# Altium project Amber_Main_Board.PrjPCB
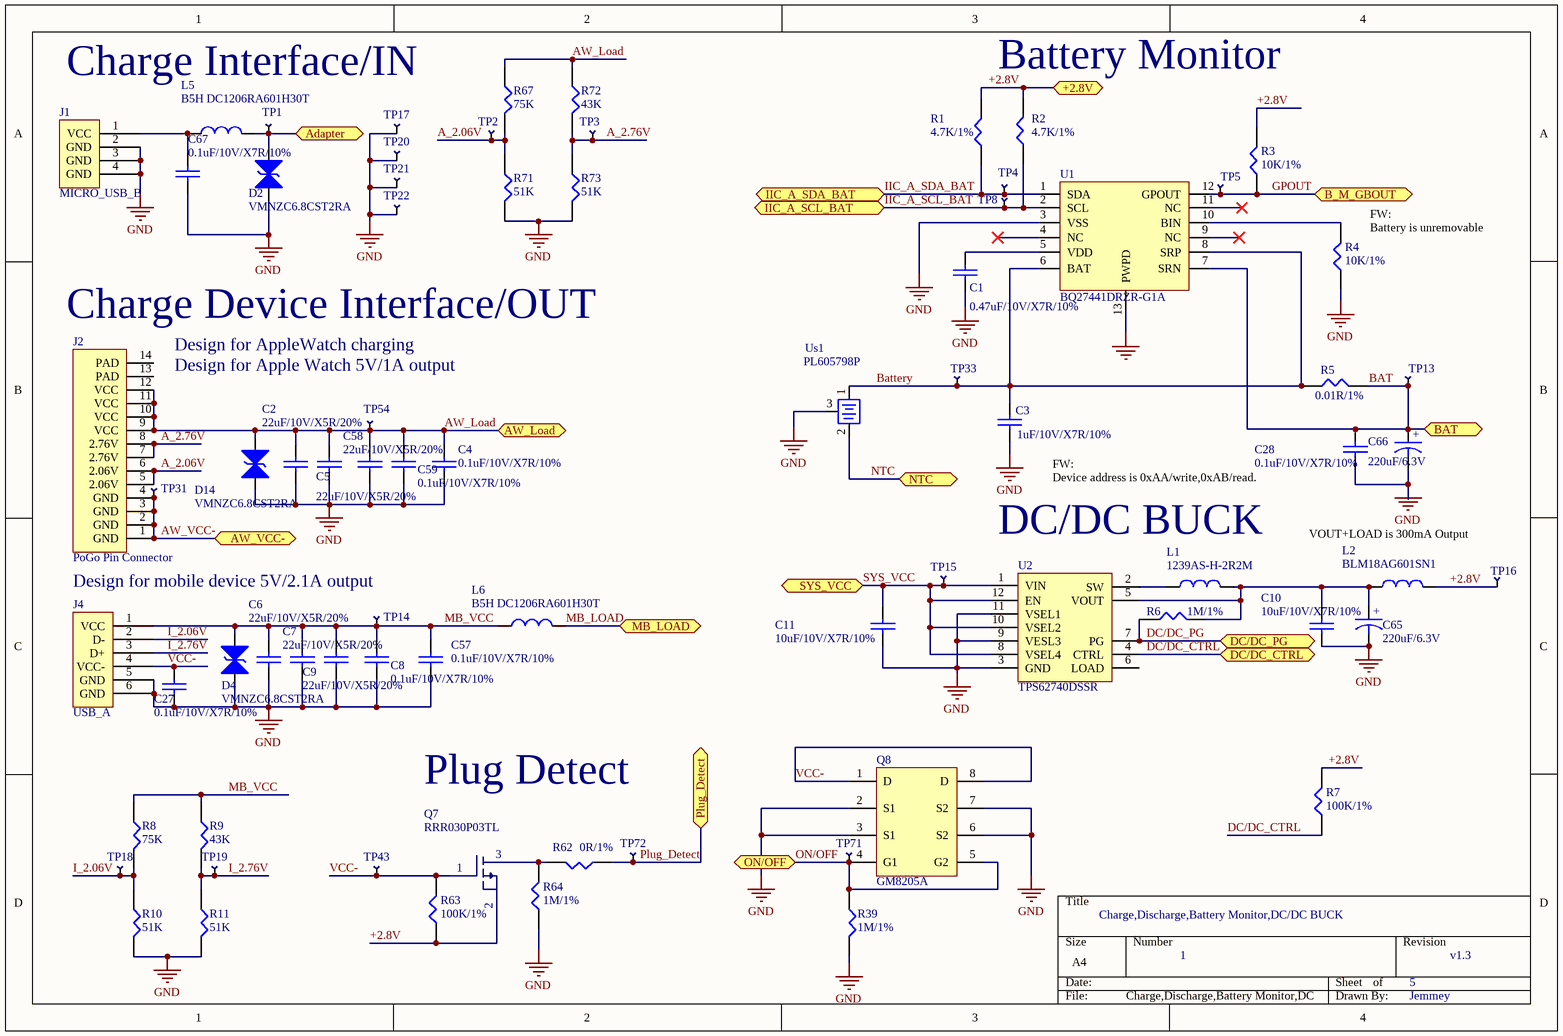
[diagram p0: Charge,Discharge,Battery Monitor,DC DC BUCK.SchDoc]
5 sheets, 237 parts. Net scope: global (net labels, ports and power ports of the same name join across sheets).
Board file: Amber_Main_Board.PcbDoc
Sheets:
  Charge,Discharge,Battery Monitor,DC DC BUCK.SchDoc
  WindCharger.SchDoc
  Management of Charging,Discharging,Tri-axis angle sensor.SchDoc
  BLE MCU,Watch Dog and Reset,EEPROM,Buzzer.SchDoc
  Breath LED,Temp,Touch key,Motor.SchDoc

## Sheet Charge,Discharge,Battery Monitor,DC DC BUCK.SchDoc
size A4

### Parts
C1  0.47uF/10V/X7R/10%  [0402C]
C2  22uF/10V/X5R/20%  [0603C]
C3  1uF/10V/X7R/10%  [0402C]
C4  0.1uF/10V/X7R/10%  [0402C]
C5  22uF/10V/X5R/20%  [0603C]
C6  22uF/10V/X5R/20%  [0603C]
C7  22uF/10V/X5R/20%  [0603C]
C8  0.1uF/10V/X7R/10%  [0402C]
C9  22uF/10V/X5R/20%  [0603C]
C10  10uF/10V/X7R/10%  [0603C]
C11  10uF/10V/X7R/10%  [0603C]
C27  0.1uF/10V/X7R/10%  [0402C]
C28  0.1uF/10V/X7R/10%  [0402C]
C57  0.1uF/10V/X7R/10%  [0402C]
C58  22uF/10V/X5R/20%  [0603C]
C59  0.1uF/10V/X7R/10%  [0402C]
C65  220uF/6.3V  [3216]
C66  220uF/6.3V  [3216]
C67  0.1uF/10V/X7R/10%  [0402C]
D2  VMNZC6.8CST2RA  [0402]
D4  VMNZC6.8CST2RA  [0402]
D14  VMNZC6.8CST2RA  [0402]
J1  MICRO_USB_B  [Micro-USB-AVX-PAD]
J2  PoGo Pin Connector  [FPC_CON12-BACK-MOLEX]
J4  USB_A  [USB-A-2]
L1  1239AS-H-2R2M  [2520-TOKO]
L2  BLM18AG601SN1  [0603R]
L5  B5H DC1206RA601H30T  [1206]
L6  B5H DC1206RA601H30T  [1206]
Q7  RRR030P03TL  [TSMT3]
Q8  GM8205A  [TSSOP-8]
R1  4.7K/1%  [0402R]
R2  4.7K/1%  [0402R]
R3  10K/1%  [0402R]
R4  10K/1%  [0402R]
R5  0.01R/1%  [0805]
R6  1M/1%  [0402R]
R7  100K/1%  [0402R]
R8  75K  [0402R]
R9  43K  [0402R]
R10  51K  [0402R]
R11  51K  [0402R]
R39  1M/1%  [0402R]
R62  0R/1%  [0402R]
R63  100K/1%  [0402R]
R64  1M/1%  [0402R]
R67  75K  [0402R]
R71  51K  [0402R]
R72  43K  [0402R]
R73  51K  [0402R]
TP1  TEST  [Test Pad]  (value not drawn)
TP2  TEST  [Test Pad]  (value not drawn)
TP3  TEST  [Test Pad]  (value not drawn)
TP4  TEST  [Test Pad]  (value not drawn)
TP5  TEST  [Test Pad]  (value not drawn)
TP8  TEST  [Test Pad]  (value not drawn)
TP13  TEST  [Test Pad]  (value not drawn)
TP14  TEST  [Test Pad]  (value not drawn)
TP15  TEST  [Test Pad]  (value not drawn)
TP16  TEST  [Test Pad]  (value not drawn)
TP17  TEST  [Test Pad]  (value not drawn)
TP18  TEST  [Test Pad]  (value not drawn)
TP19  TEST  [Test Pad]  (value not drawn)
TP20  TEST  [Test Pad]  (value not drawn)
TP21  TEST  [Test Pad]  (value not drawn)
TP22  TEST  [Test Pad]  (value not drawn)
TP31  TEST  [Test Pad]  (value not drawn)
TP33  TEST  [Test Pad]  (value not drawn)
TP43  TEST  [Test Pad]  (value not drawn)
TP54  TEST  [Test Pad]  (value not drawn)
TP71  TEST  [Test Pad]  (value not drawn)
TP72  TEST  [Test Pad]  (value not drawn)
U1  BQ27441DRZR-G1A  [DRZ]
U2  TPS62740DSSR  [DSS]
Us1  PL605798P  [Battery]

### Ports
+2.8V, Adapter (bidir), AW_Load (bidir), AW_VCC- (bidir), B_M_GBOUT, BAT, DC/DC_CTRL (bidir), DC/DC_PG (bidir), IIC_A_SCL_BAT (bidir), IIC_A_SDA_BAT (bidir), MB_LOAD (bidir), NTC, ON/OFF (bidir), Plug_Detect (bidir), SYS_VCC (bidir)

### Nets
+2.8V: L2.2 Q7.2(S) R1.2 R2.2 R3.2 R7.2 R63.1 TP16.1 ; port +2.8V
GND: C1.2 C2.2 C3.2 C4.2 C5.2 C6.2 C7.2 C8.2 C9.2 C10.2 C11.2 C27.2 C28.2 C57.2 C58.2 C59.2 C65.2 C66.2 C67.2 D2.1(Diode1) D4.1(Diode1) D14.1(Diode1) J1.2(GND) J1.3(GND) J1.4(GND) J4.5(GND) J4.6(GND) Q8.2(S1) Q8.3(S1) Q8.6(S2) Q8.7(S2) R4.1 R10.2 R11.2 R39.2 R64.1 R71.2 R73.2 TP17.1 TP20.1 TP21.1 TP22.1 U1.3(VSS) U1.13(PWPD) U2.3(GND) U2.9(VESL3) U2.11(VSEL1) Us1.3(GND)
A_2.06V: J2.5(2.06V) J2.6(2.06V) R67.2 R71.1 TP2.1
A_2.76V: J2.7(2.76V) J2.8(2.76V) R72.2 R73.1 TP3.1
Adapter: D2.2(dIode2) L5.2 TP1.1 ; port Adapter
AW_Load: C2.1 C4.1 C5.1 C58.1 C59.1 D14.2(dIode2) J2.9(VCC) J2.10(VCC) J2.11(VCC) J2.12(VCC) R67.1 R72.1 TP54.1 ; port AW_Load
AW_VCC-: J2.1(GND) J2.2(GND) J2.3(GND) J2.4(GND) TP31.1 ; port AW_VCC-
BAT: C28.1 C66.1 R5.2 TP13.1 U1.7(SRN) ; port BAT
Battery: C3.1 R5.1 TP33.1 U1.6(BAT) U1.8(SRP) Us1.1(VCC)
DC/DC_CTRL: R7.1 U2.4(CTRL) ; port DC/DC_CTRL
DC/DC_PG: R6.1 U2.7(PG) ; port DC/DC_PG
GPOUT: R3.1 TP5.1 U1.12(GPOUT) ; port B_M_GBOUT
I_2.06V: J4.2(D-) R8.2 R10.1 TP18.1
I_2.76V: J4.3(D+) R9.2 R11.1 TP19.1
IIC_A_SCL_BAT: R2.1 TP8.1 U1.2(SCL) ; port IIC_A_SCL_BAT
IIC_A_SDA_BAT: R1.1 TP4.1 U1.1(SDA) ; port IIC_A_SDA_BAT
MB_LOAD: L6.2 ; port MB_LOAD
MB_VCC: C6.1 C7.1 C8.1 C9.1 C57.1 D4.2(dIode2) J4.1(VCC) L6.1 R8.1 R9.1 TP14.1
NTC: Us1.2(NTC) ; port NTC
ON/OFF: Q8.4(G1) Q8.5(G2) R39.1 TP71.1 ; port ON/OFF
Plug_Detect: R62.1 TP72.1 ; port Plug_Detect
SYS_VCC: C11.1 TP15.1 U2.1(VIN) U2.8(VSEL4) U2.10(VSEL2) U2.12(EN) ; port SYS_VCC
VCC-: C27.1 J4.4(VCC-) Q7.1(G) Q8.1(D) Q8.8(D) R63.2 TP43.1
NetC1_1: C1.1 U1.5(VDD)
NetC10_1: C10.1 C65.1 L1.2 L2.1 R6.2 U2.5(VOUT)
NetC67_1: C67.1 J1.1(VCC) L5.1
NetL1_1: L1.1 U2.2(SW)
NetQ7_3: Q7.3(D) R62.2 R64.2
NetR4_2: R4.2 U1.10(BIN)

Not connected (* = marked no-connect by the designer): J2 13(PAD) 14(PAD); U1 4(NC)* 9(NC)* 11(NC)*; U2 6(LOAD)

### Notes on the sheet
- (near R67) Charge Interface/IN
- Battery Monitor
- (near R4) FW:
  Battery is unremovable
- (near J2) Charge Device Interface/OUT
- Design for AppleWatch charging
- Design for Apple Watch 5V/1A output
- (near C3) FW:
  Device address is 0xAA/write,0xAB/read.
- DC/DC BUCK
- VOUT+LOAD is 300mA Output
- Design for mobile device 5V/2.1A output
- Plug Detect
- Charge,Discharge,Battery Monitor,DC/DC BUCK
- 1
- 5
- v1.3
- Jemmey
- (in symbol Capacitor) +

### Library data of the parts
C1 = CAP: 厂家：Murata，型号：GRM155R71A474KE01D
C2 C5-C7 C9 C58 = CAP: 厂家：Murata，型号：GRM188R61A226ME15D
C3 = CAP: 厂家：Murata，型号：GRM155R61C105KA12D
C4 C8 C27 C28 C57 C59 C67 = CAP: 厂家：Murata，型号：GRM155R71A104KA01D
C10 C11 = CAP: 厂家：Murata，型号：GRM188R61A106KE69D
C65 C66 = Capacitor: 厂家：ROHM，型号：TAJC227K010RNJ
D2 D4 D14 = ESD_1: 厂家：ROHM，型号：VMNZC6.8CST2RA
J1 = USB_B: 厂家：AVX，型号：20-6751-005-001-007
J2 = Po: 厂家：MOLEX，型号：5034801200_sd
J4 = USB_A: 厂家：FCI，型号：87583
L1 = CHOKE: 厂家：Toko，型号1239AS-H-2R2M
L2 = CHOKE: 厂家：MURATA，型号：BLM18AG601SN1
L5 L6 = CHOKE: 厂家：宇磁，型号：B5H DC1206RA601H30T
Q7 = PMOS: 厂家：ROHM，型号：RRR030P03TL
Q8 = GM8205A: 厂家：晶群科技，型号：GM8205A
R1 R2 = RES1: 厂家：Yageo，型号：RC0402FR-074K7L
R3 R4 = RES1: 厂家：Yageo，型号：RC0402FR-0710KL
R5 = RES1: 厂家：Yageo，型号：RL0805FR-070R01L
R6 R39 = RES1: 厂家：Yageo，型号：RC0402FR-071ML
R7 = RES1: 厂家：Yageo，型号：RC0402FR-07100KL
R8 R67 = RES1: 厂家：Yageo，型号：RC0402FR-0775KL
R9 R72 = RES1: 厂家：Yageo，型号：RC0402FR-0743K9L
R10 R11 R71 R73 = RES1: 厂家：Yageo，型号：RC0402FR-0751K9L
R62 = RES1: 厂家：Yageo，型号：RC0402FR-070RL
R63 = RES: 厂家：Yageo，型号：RC0402FR-07100KL
R64 = RES: 厂家：Yageo，型号：RC0402FR-071ML
TP1-TP5 TP8 TP13-TP22 TP31 TP33 TP43 TP54 TP71 TP72 = TEST: Test Point
U1 = Bq27411: 厂家：TI，型号：BQ27441DRZR-G1A
U2 = TPS62740: 厂家：TI，型号：TPS62740DSSR
Us1 = BAT: 厂家：红亚山，型号：PL605798P

## Sheet WindCharger.SchDoc
size A4
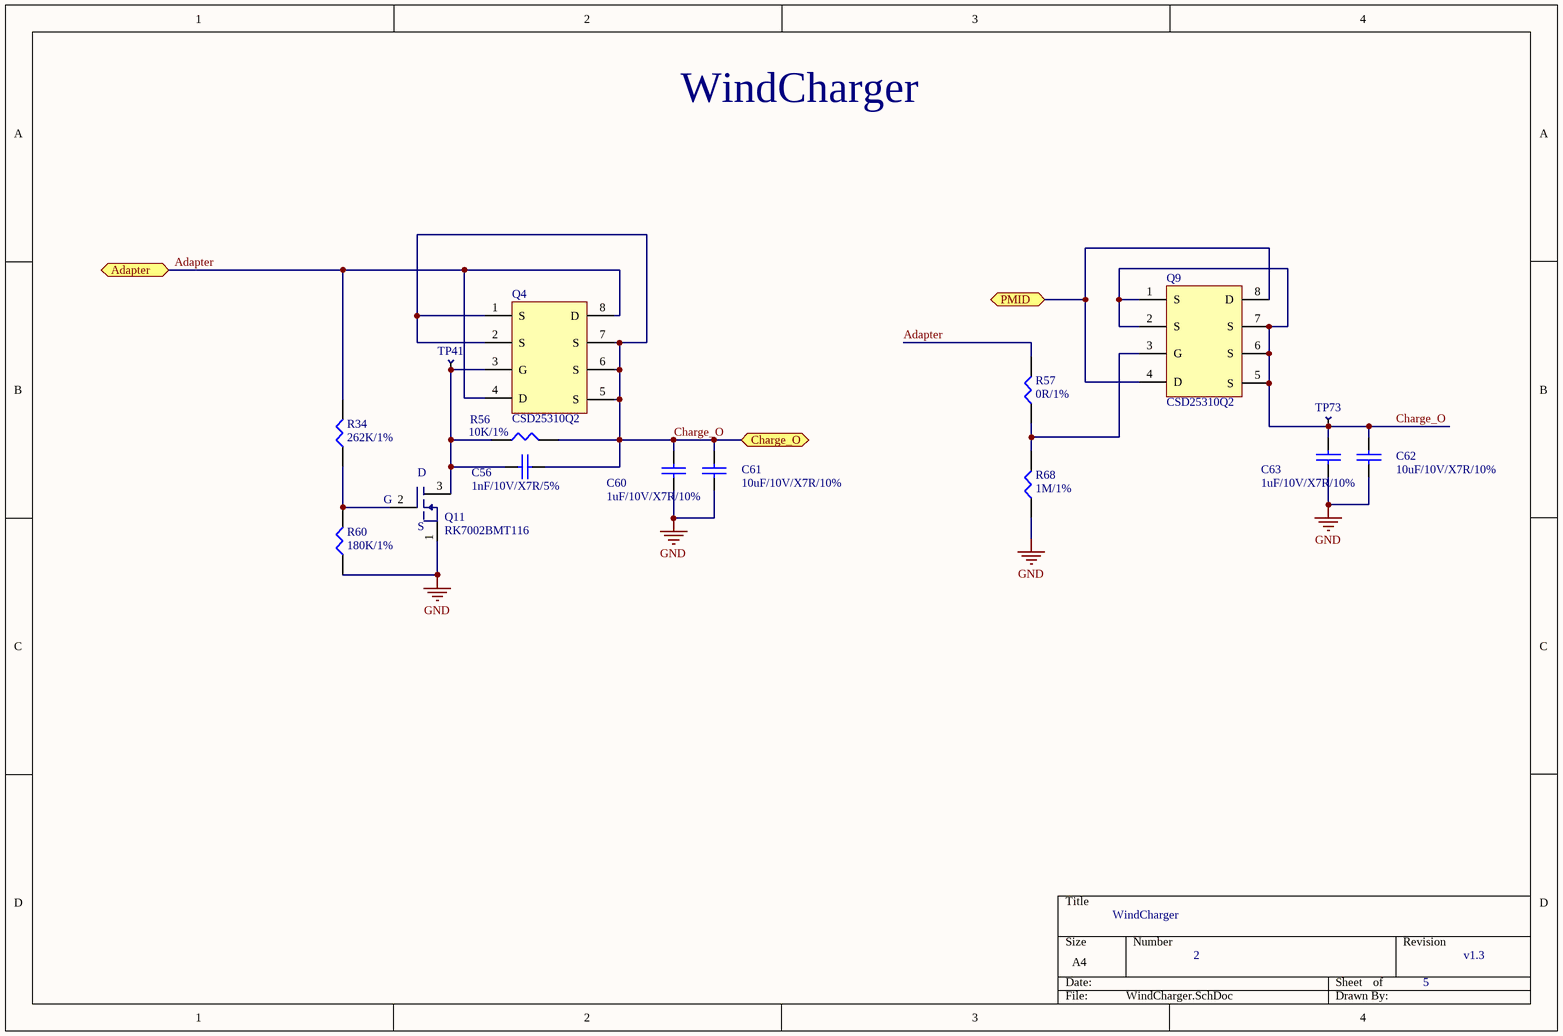
[diagram p1: WindCharger.SchDoc]

### Parts
C56  1nF/10V/X7R/5%  [0402C]
C60  1uF/10V/X7R/10%  [0402C]
C61  10uF/10V/X7R/10%  [0603C]
C62  10uF/10V/X7R/10%  [0603C]
C63  1uF/10V/X7R/10%  [0402C]
Q4  CSD25310Q2  [DQK]
Q9  CSD25310Q2  [DQK]
Q11  RK7002BMT116  [SOT23]
R34  262K/1%  [0402R]
R56  10K/1%  [0402R]
R57  0R/1%  [0402R]
R60  180K/1%  [0402R]
R68  1M/1%  [0402R]
TP41  TEST  [Test Pad]  (value not drawn)
TP73  TEST  [Test Pad]  (value not drawn)

### Ports
Adapter (bidir), Charge_O (bidir), PMID (bidir)

### Nets
GND: C60.2 C61.2 C62.2 C63.2 Q11.1(S) R60.1 R68.1
Adapter: Q4.4(D) Q4.8(D) R34.2 R57.2 ; port Adapter
Charge_O: C56.2 C60.1 C61.1 C62.1 C63.1 Q4.1(S) Q4.2(S) Q4.5(S) Q4.6(S) Q4.7(S) Q9.1(S) Q9.2(S) Q9.5(S) Q9.6(S) Q9.7(S) R56.2 TP73.1 ; port Charge_O
PMID: Q9.4(D) Q9.8(D) ; port PMID
NetC56_1: C56.1 Q4.3(G) Q11.3(D) R56.1 TP41.1
NetQ9_3: Q9.3(G) R57.1 R68.2
NetQ11_2: Q11.2(G) R34.1 R60.2

### Notes on the sheet
- WindCharger
- 2
- 5
- v1.3

### Library data of the parts
C56 = CAP: 厂家：Murata，型号：GRM1555C1H102JA01D
C60 C63 = CAP: 厂家：Murata，型号：GRM155R61C105KA12D
C61 C62 = CAP: 厂家：Murata，型号：GRM188R61A106KE69D
Q4 Q9 = CSD25310Q2: 厂家：TI，型号：   CSD25310Q2
Q11 = RK7002: 厂家：Vishay，型号：RK7002BMT116
R34 = RES1: 厂家：Yageo，型号：RC0402FR-07262KL
R56 = RES1: 厂家：Yageo，型号：RC0402FR-0710KL
R57 R68 = RES1: 厂家：Yageo，型号：RC0402FR-071ML
R60 = RES1: 厂家：Yageo，型号：RC0402FR-07180KL
TP41 TP73 = TEST: Test Point

## Sheet Management of Charging,Discharging,Tri-axis angle sensor.SchDoc
size A4
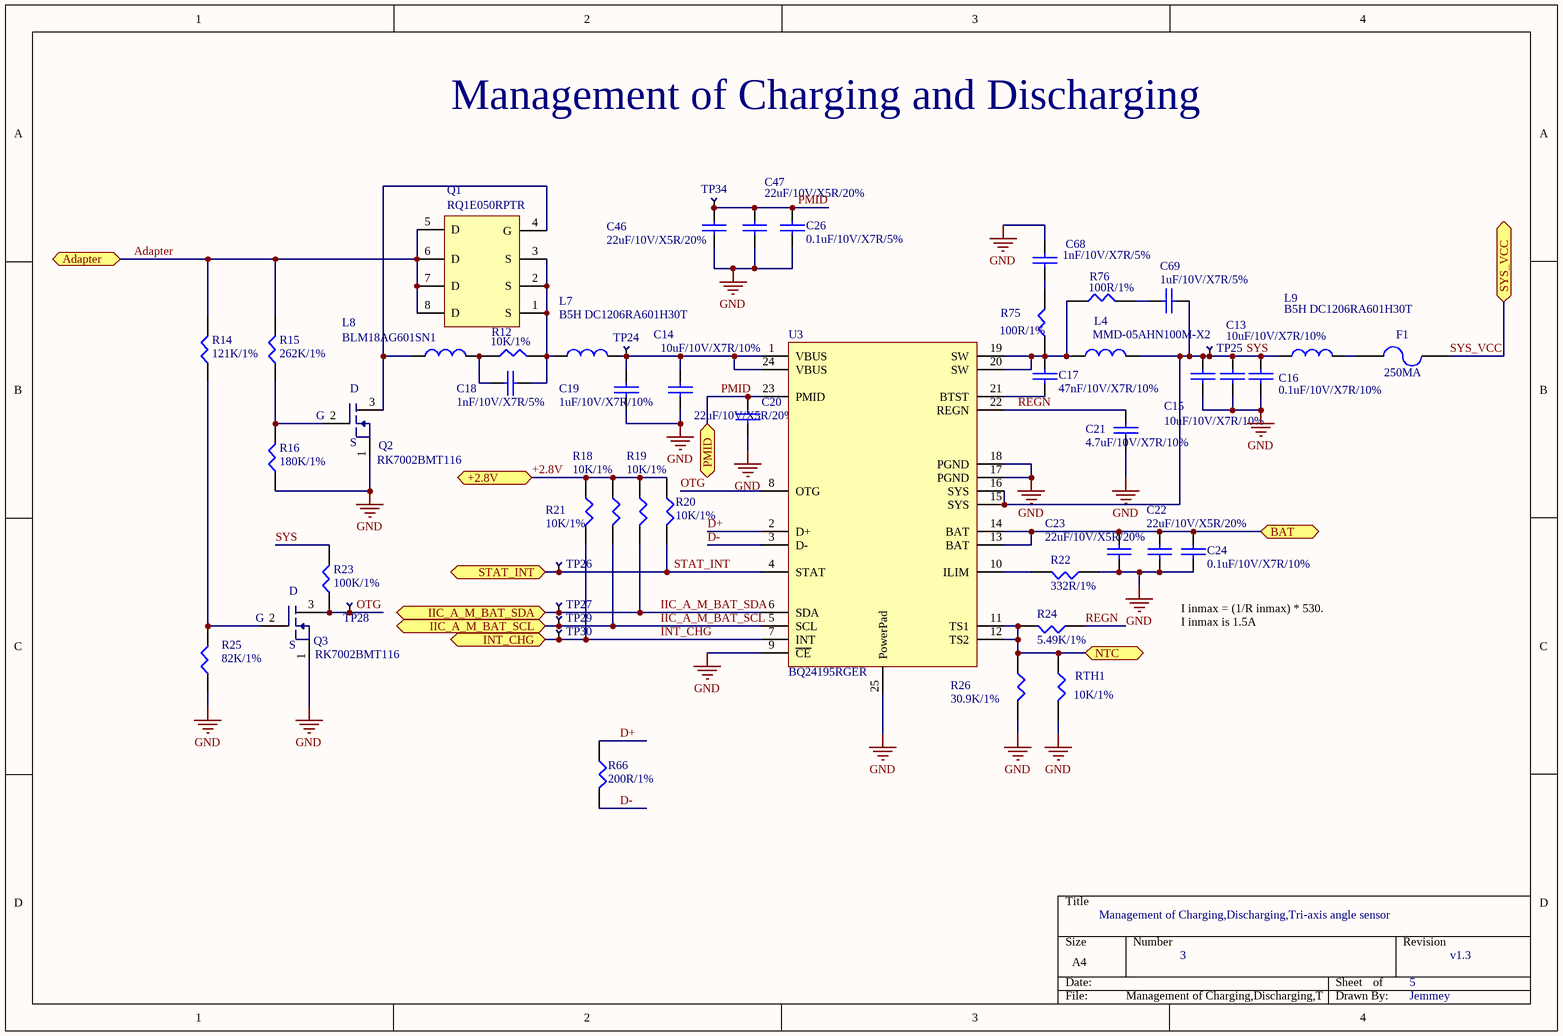
[diagram p2: Management of Charging,Discharging,Tri-axis angle sensor.SchDoc]

### Parts
C13  10uF/10V/X7R/10%  [0603C]
C14  10uF/10V/X7R/10%  [0603C]
C15  10uF/10V/X7R/10%  [0603C]
C16  0.1uF/10V/X7R/10%  [0402C]
C17  47nF/10V/X7R/10%  [0402C]
C18  1nF/10V/X7R/5%  [0402C]
C19  1uF/10V/X7R/10%  [0402C]
C20  22uF/10V/X5R/20%  [0603C]
C21  4.7uF/10V/X7R/10%  [0603C]
C22  22uF/10V/X5R/20%  [0603C]
C23  22uF/10V/X5R/20%  [0603C]
C24  0.1uF/10V/X7R/10%  [0402C]
C26  0.1uF/10V/X7R/5%  [0402C]
C46  22uF/10V/X5R/20%  [0603C]
C47  22uF/10V/X5R/20%  [0603C]
C68  1nF/10V/X7R/5%  [0603C]
C69  1uF/10V/X7R/5%  [0603C]
F1  250MA  [1206-FUSE]
L4  MMD-05AHN100M-X2  [MMD]
L7  B5H DC1206RA601H30T  [1206]
L8  BLM18AG601SN1  [0603R]
L9  B5H DC1206RA601H30T  [1206]
Q1  RQ1E050RPTR  [TSMT8]
Q2  RK7002BMT116  [SOT23]
Q3  RK7002BMT116  [SOT23]
R12  10K/1%  [0402R]
R14  121K/1%  [0402R]
R15  262K/1%  [0402R]
R16  180K/1%  [0402R]
R18  10K/1%  [0402R]
R19  10K/1%  [0402R]
R20  10K/1%  [0402R]
R21  10K/1%  [0402R]
R22  332R/1%  [0402R]
R23  100K/1%  [0402R]
R24  5.49K/1%  [0402R]
R25  82K/1%  [0402R]
R26  30.9K/1%  [0402R]
R66  200R/1%  [0402R]
R75  100R/1%  [0603R]
R76  100R/1%  [0603R]
RTH1  10K/1%  [0402R]
TP24  TEST  [Test Pad]  (value not drawn)
TP25  TEST  [Test Pad]  (value not drawn)
TP26  TEST  [Test Pad]  (value not drawn)
TP27  TEST  [Test Pad]  (value not drawn)
TP28  TEST  [Test Pad]  (value not drawn)
TP29  TEST  [Test Pad]  (value not drawn)
TP30  TEST  [Test Pad]  (value not drawn)
TP34  TEST  [Test Pad]  (value not drawn)
U3  BQ24195RGER  [RGE]

### Ports
+2.8V (bidir), Adapter (bidir), BAT, IIC_A_M_BAT_SCL, IIC_A_M_BAT_SDA, INT_CHG, NTC, PMID (bidir), STAT_INT (bidir), SYS_VCC (bidir)

### Nets
+2.8V: R18.1 R19.1 R20.1 R21.1 ; port +2.8V
GND: C13.2 C14.2 C15.2 C16.2 C19.2 C20.2 C21.2 C22.2 C23.2 C24.2 C26.1 C46.2 C47.2 C68.2 Q2.1(S) Q3.1(S) R16.1 R22.1 R25.1 R26.2 RTH1.2 U3.9(~{CE}) U3.17(PGND) U3.18(PGND) U3.25(PowerPad)
Adapter: Q1.5(D) Q1.6(D) Q1.7(D) Q1.8(D) R14.2 R15.2 ; port Adapter
BAT: C22.1 C23.1 C24.1 U3.13(BAT) U3.14(BAT) ; port BAT
D+: R66.1 U3.2(D+)
D-: R66.2 U3.3(D-)
IIC_A_M_BAT_SCL: R18.2 TP29.1 U3.5(SCL) ; port IIC_A_M_BAT_SCL
IIC_A_M_BAT_SDA: R19.2 TP27.1 U3.6(SDA) ; port IIC_A_M_BAT_SDA
INT_CHG: R21.2 TP30.1 U3.7(INT) ; port INT_CHG
NTC: R24.2 R26.1 RTH1.1 U3.11(TS1) U3.12(TS2) ; port NTC
OTG: Q3.3(D) R23.1 TP28.1 U3.8(OTG)
PMID: C20.1 C26.2 C46.1 C47.1 TP34.1 U3.23(PMID) ; port PMID
REGN: C21.1 R24.1 U3.22(REGN)
STAT_INT: R20.2 TP26.1 U3.4(STAT) ; port STAT_INT
SYS: C13.1 C15.1 C16.1 C69.1 L4.2 L9.1 R23.2 TP25.1 U3.15(SYS) U3.16(SYS)
SYS_VCC: F1.1 ; port SYS_VCC
NetC14_1: C14.1 C19.1 L7.2 TP24.1 U3.1(VBUS) U3.24(VBUS)
NetC17_1: C17.1 L4.1 R75.1 R76.1 U3.19(SW) U3.20(SW)
NetC17_2: C17.2 U3.21(BTST)
NetC18_1: C18.1 L8.2 R12.1
NetC18_2: C18.2 L7.1 Q1.1(S) Q1.2(S) Q1.3(S) R12.2
NetC68_1: C68.1 R75.2
NetC69_2: C69.2 R76.2
NetF1_2: F1.2 L9.2
NetL8_1: L8.1 Q1.4(G) Q2.3(D)
NetQ2_2: Q2.2(G) R15.1 R16.2
NetQ3_2: Q3.2(G) R14.1 R25.2
NetR22_2: R22.2 U3.10(ILIM)

### Notes on the sheet
- Management of Charging and Discharging
- I inmax = (1/R inmax) * 530.
  I inmax is 1.5A
- Management of Charging,Discharging,Tri-axis angle sensor
- 3
- 5
- v1.3
- Jemmey

### Library data of the parts
C13-C15 = CAP: 厂家：Murata，型号：GRM188R61A106KE69D
C16 C24 = CAP: 厂家：Murata，型号：GRM155R71A104KA01D
C17 = CAP: 厂家：Murata，型号：GRM155R71H473KE14D
C18 C26 C69 = CAP: 厂家：Murata，型号：GRM1555C1H102JA01D
C19 = CAP: 厂家：Murata，型号：GRM155R61C105KA12D
C20 C22 C23 C46 C47 = CAP: 厂家：Murata，型号：GRM188R61A226ME15D
C21 = CAP: 厂家：Murata，型号：GRM188R61A475KE15D
C68 = CAP: 厂家：Murata，型号：
F1 = FUSE2: 厂家：万瑞和，型号：WH1206-050
L4 = CHOKE: 厂家：Mag，型号：MMD-05AHN100M-X2
L7 L9 = CHOKE: 厂家：宇磁，型号：B5H DC1206RA601H30T
L8 = CHOKE: 厂家：MURATA，型号：BLM18AG601SN1
Q1 = RQ1: 厂家：ROHM，型号：   RQ1E050RPTR
Q2 Q3 = RK7002BMT116: 厂家：Vishay，型号：RK7002BMT116
R12 R18-R21 R75 R76 RTH1 = RES1: 厂家：Yageo，型号：RC0402FR-0710KL
R14 = RES1: 厂家：Yageo，型号：RC0402FR-07121KL
R15 = RES1: 厂家：Yageo，型号：RC0402FR-07262KL
R16 = RES1: 厂家：Yageo，型号：RC0402FR-07180KL
R22 = RES1: 厂家：Yageo，型号：RC0402FR-07332RL
R23 = RES1: 厂家：Yageo，型号：RC0402FR-07100KL
R24 = RES1: 厂家：Yageo，型号：RC0402FR-075K49L
R25 = RES1: 厂家：Yageo，型号：RC0402FR-0782KL
R26 = RES1: 厂家：Yageo，型号：RC0402FR-0730K9L
R66 = RES1: 厂家：Yageo，型号：RC0402FR-07200RL
TP24-TP30 TP34 = TEST: Test Point
U3 = BQ: 厂家：TI，型号：BQ24195RGER

## Sheet BLE MCU,Watch Dog and Reset,EEPROM,Buzzer.SchDoc
size A4
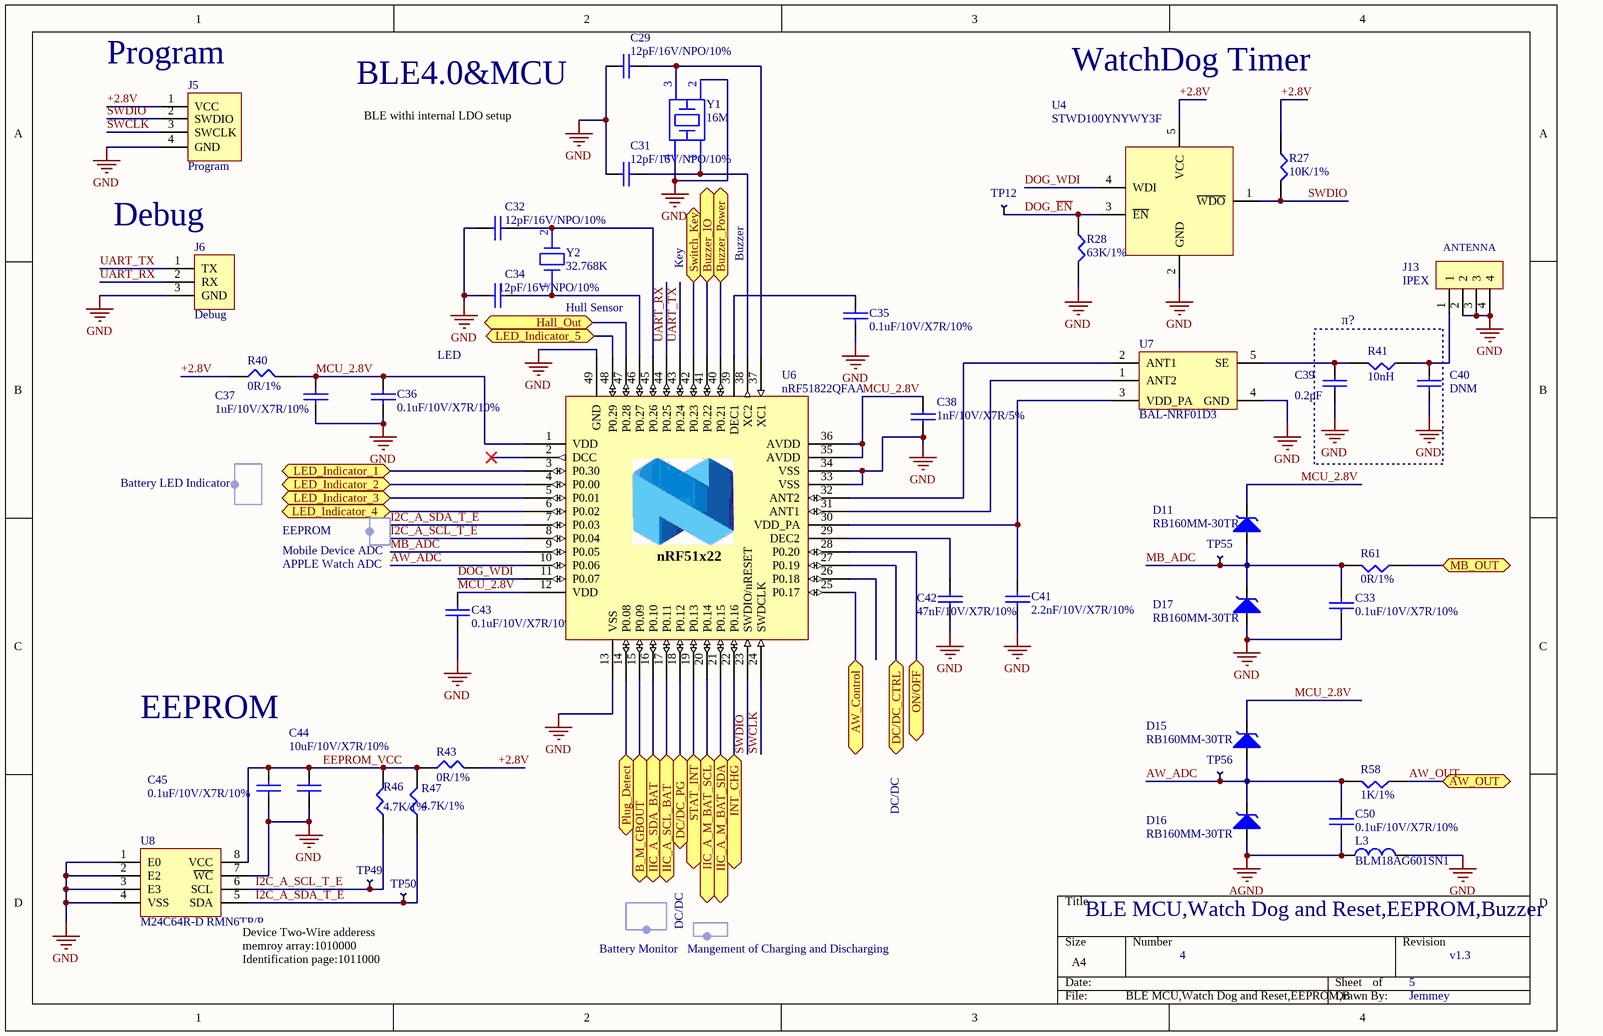
[diagram p3: BLE MCU,Watch Dog and Reset,EEPROM,Buzzer.SchDoc]

### Parts
C29  12pF/16V/NPO/10%  [0402C]
C31  12pF/16V/NPO/10%  [0402C]
C32  12pF/16V/NPO/10%  [0402C]
C33  0.1uF/10V/X7R/10%  [0402C]
C34  12pF/16V/NPO/10%  [0402C]
C35  0.1uF/10V/X7R/10%  [0402C]
C36  0.1uF/10V/X7R/10%  [0402C]
C37  1uF/10V/X7R/10%  [0402C]
C38  1nF/10V/X7R/5%  [0402C]
C39  0.2pF  [0402C]
C40  DNM  [0402C]
C41  2.2nF/10V/X7R/10%  [0402C]
C42  47nF/10V/X7R/10%  [0402C]
C43  0.1uF/10V/X7R/10%  [0402C]
C44  10uF/10V/X7R/10%  [0603C]
C45  0.1uF/10V/X7R/10%  [0402C]
C50  0.1uF/10V/X7R/10%  [0402C]
D11  RB160MM-30TR  [DO-214AC]
D15  RB160MM-30TR  [DO-214AC]
D16  RB160MM-30TR  [DO-214AC]
D17  RB160MM-30TR  [DO-214AC]
J5  Program  [PROGRAM - 1.27]
J6  Debug  [Debug- 1.27]
J13  IPEX  [IPEX]
L3  BLM18AG601SN1  [0603R]
R27  10K/1%  [0402R]
R28  63K/1%  [0402R]
R40  0R/1%  [0603R]
R41  10nH  [0402R]
R43  0R/1%  [0603R]
R46  4.7K/1%  [0402R]
R47  4.7K/1%  [0402R]
R58  1K/1%  [0402R]
R61  0R/1%  [0402R]
TP12  TEST  [Test Pad]  (value not drawn)
TP49  TEST  [Test Pad]  (value not drawn)
TP50  TEST  [Test Pad]  (value not drawn)
TP55  TEST  [Test Pad]  (value not drawn)
TP56  TEST  [Test Pad]  (value not drawn)
U4  STWD100YNYWY3F  [SOT23-5]
U6  nRF51822QFAA  [QFN48]
U7  BAL-NRF01D3  [ECOPACK]
U8  M24C64R-D RMN6TP/P  [SO8N]
Y1  16M  [XTALSMD2-2520]
Y2  32.768K  [XTALSMD2-3215]

### Blocks framed on the sheet
π?: C39 C40 R41

### Ports
AW_Control, AW_OUT (bidir), B_M_GBOUT, Buzzer_IO, Buzzer_Power, DC/DC_CTRL (bidir), DC/DC_PG (bidir), Hall_Out (bidir), IIC_A_M_BAT_SCL (bidir), IIC_A_M_BAT_SDA (bidir), IIC_A_SCL_BAT (bidir), IIC_A_SDA_BAT (bidir), INT_CHG, LED_Indicator_1 (bidir), LED_Indicator_2 (bidir), LED_Indicator_3 (bidir), LED_Indicator_4, LED_Indicator_5, MB_OUT (bidir), ON/OFF (bidir), Plug_Detect (bidir), STAT_INT, Switch_Key

### Harnesses
Battery Monitor: 
EEPROM: 
Mangement of Charging and Discharging: 
Battery LED Indicator: 

### Nets
+2.8V: J5.1(VCC) R27.1 R40.1 R43.2 U4.5(VCC)
AGND: C50.2 D16.2(A) L3.1
GND: C29.1 C31.1 C32.1 C33.2 C34.1 C35.1 C36.1 C37.1 C38.1 C39.2 C40.2 C41.1 C42.1 C43.1 C44.2 C45.2 D17.2(A) J5.4(GND) J6.3(GND) J13.2 J13.3 J13.4 L3.2 R28.2 U4.2(GND) U6.13(VSS) U6.33(VSS) U6.34(VSS) U6.49(GND) U7.4(GND) U8.1(E0) U8.2(E2) U8.3(E3) U8.4(VSS) U8.7(~{WC}) Y1.2 Y1.4
AW_ADC: C50.1 D15.2(A) D16.1(K) R58.2 TP56.1 U6.10(P0.06)
AW_OUT: R58.1 ; port AW_OUT
Buzzer_IO: U6.41(P0.22) ; port Buzzer_IO
Buzzer_Power: U6.40(P0.21) ; port Buzzer_Power
DC/DC_CTRL: U6.27(P0.19) ; port DC/DC_CTRL
DC/DC_PG: U6.18(P0.12) ; port DC/DC_PG
DOG_~{EN}: R28.1 TP12.1 U4.3(~{EN})
DOG_WDI: U4.4(WDI) U6.11(P0.07)
EEPROM_VCC: C44.1 C45.1 R43.1 R46.2 R47.2 U8.8(VCC)
GPOUT: U6.15(P0.09) ; port B_M_GBOUT
Hall_OUT: U6.47(P0.28) ; port Hall_Out
I2C_A_SCL_T_E: R46.1 TP49.1 U6.8(P0.04) U8.6(SCL)
I2C_A_SDA_T_E: R47.1 TP50.1 U6.7(P0.03) U8.5(SDA)
IIC_A_M_BAT_SCL: U6.20(P0.14) ; port IIC_A_M_BAT_SCL
IIC_A_M_BAT_SDA: U6.21(P0.15) ; port IIC_A_M_BAT_SDA
IIC_A_SCL_BAT: U6.17(P0.11) ; port IIC_A_SCL_BAT
IIC_A_SDA_BAT: U6.16(P0.10) ; port IIC_A_SDA_BAT
INT_CHG: U6.22(P0.16) ; port INT_CHG
MB_ADC: C33.1 D11.2(A) D17.1(K) R61.2 TP55.1 U6.9(P0.05)
MCU_2.8V: C36.2 C37.2 C38.2 C43.2 D11.1(K) D15.1(K) R40.2 U6.1(VDD) U6.12(VDD) U6.35(AVDD) U6.36(AVDD)
ON/OFF: U6.28(P0.20) ; port ON/OFF
Plug_Detect: U6.14(P0.08) ; port Plug_Detect
STAT_INT: U6.19(P0.13) ; port STAT_INT
SWCLK: J5.3(SWCLK) U6.24(SWDCLK)
SWDIO: J5.2(SWDIO) R27.2 U4.1(~{WDO}) U6.23(SWDIO/nRESET)
Switch_Key: U6.42(P0.23) ; port Switch_Key
UART_RX: J6.2(RX) U6.44(P0.25)
UART_TX: J6.1(TX) U6.43(P0.24)
NetC29_2: C29.2 U6.37(XC1) Y1.3
NetC31_2: C31.2 U6.38(XC2) Y1.1
NetC32_2: C32.2 U6.45(P0.26) Y2.2
NetC34_2: C34.2 U6.46(P0.27) Y2.1
NetC35_2: C35.2 U6.39(DEC1)
NetC39_1: C39.1 R41.2 U7.5(SE)
NetC40_1: C40.1 J13.1 R41.1
NetC41_2: C41.2 U6.30(VDD_PA) U7.3(VDD_PA)
NetC42_2: C42.2 U6.29(DEC2)
NetJ7_4: U6.3(P0.30) ; port LED_Indicator_1
NetJ7_5: U6.4(P0.00) ; port LED_Indicator_2
NetJ7_6: U6.5(P0.01) ; port LED_Indicator_3
NetJ7_7: U6.6(P0.02) ; port LED_Indicator_4
NetJ7_8: U6.48(P0.29) ; port LED_Indicator_5
NetQ10_2: U6.25(P0.17) ; port AW_Control
NetR61_1: R61.1 ; port MB_OUT
NetU6_31: U6.31(ANT1) U7.1(ANT2)
NetU6_32: U6.32(ANT2) U7.2(ANT1)

Not connected (* = marked no-connect by the designer): U6 2(DCC)* 26(P0.18)

### Notes on the sheet
- (near J5) Program
- BLE4.0&MCU
- WatchDog Timer
- BLE withi internal LDO setup
- Debug
- (near J13) ANTENNA
- (near Y2) Hull Sensor
- Key
- Buzzer
- LED
- APPLE Watch ADC
- Mobile Device ADC
- EEPROM
- DC/DC
- (near L3) BLE MCU,Watch Dog and Reset,EEPROM,Buzzer
- Device Two-Wire adderess
  memroy array:1010000
  Identification page:1011000
- 4
- 5
- v1.3
- Jemmey
- (in symbol nR) nRF51x22

### Library data of the parts
C29 C31 C32 C34 = CAP: 厂家：Murata，型号：GRM1555C1H120JA01D
C33 C35 C36 C43 C45 C50 = CAP: 厂家：Murata，型号：GRM155R71A104KA01D
C37 = CAP: 厂家：Murata，型号：GRM155R61C105KA12D
C38 = CAP: 厂家：Murata，型号：GRM1555C1H102JA01D
C39 = CAP: 厂家：Murata，型号：GRM1555C1H1R0BA01D
C40 = CAP: None
C41 = CAP: 厂家：Murata，型号：GRM155R71H222KA01D
C42 = CAP: 厂家：Murata，型号：GRM155R71H473KE14D
C44 = CAP: 厂家：Murata，型号：GRM188R61A106KE69D
D11 D15-D17 = Schottky barrier rec: 厂家：ROHM，型号：RB160MM-30TR
J5 = Program: 厂家：暂定，型号：暂定
J6 = Debug_1: 厂家：暂定，型号：暂定
J13 = ANTA: 厂家：Molex，型号：73420110_sd
L3 = CHOKE: 厂家：MURATA，型号：BLM18AG601SN1
R27 = RES1: 厂家：Yageo，型号：RC0402FR-0710KL
R28 = RES1: 厂家：Yageo，型号：RC0402FR-0763KL
R40 R41 R43 R58 R61 = RES1: 厂家：Yageo，型号：RC0402FR-070RL
R46 R47 = RES1: 厂家：Yageo，型号：RC0402FR-074K7L
TP12 TP49 TP50 TP55 TP56 = TEST: Test Point
U4 = S: 厂家：ST，型号：STWD100YNYWY3F
U6 = nR: 厂家：Nordic，型号：Nrf51822QFAA
U7 = BAL-NRF01D3: 厂家：ST，型号：BAL-NRF01D3
U8 = M24C64-R: 厂家：ST，型号：M24C64R-D RMN6TP/P
Y1 = CRYSTAL2: 厂家：EPSON，型号：Q24FA20H0004400
Y2 = CR: 厂家：EPSON，型号：Q13FC1350000400

## Sheet Breath LED,Temp,Touch key,Motor.SchDoc
size A4
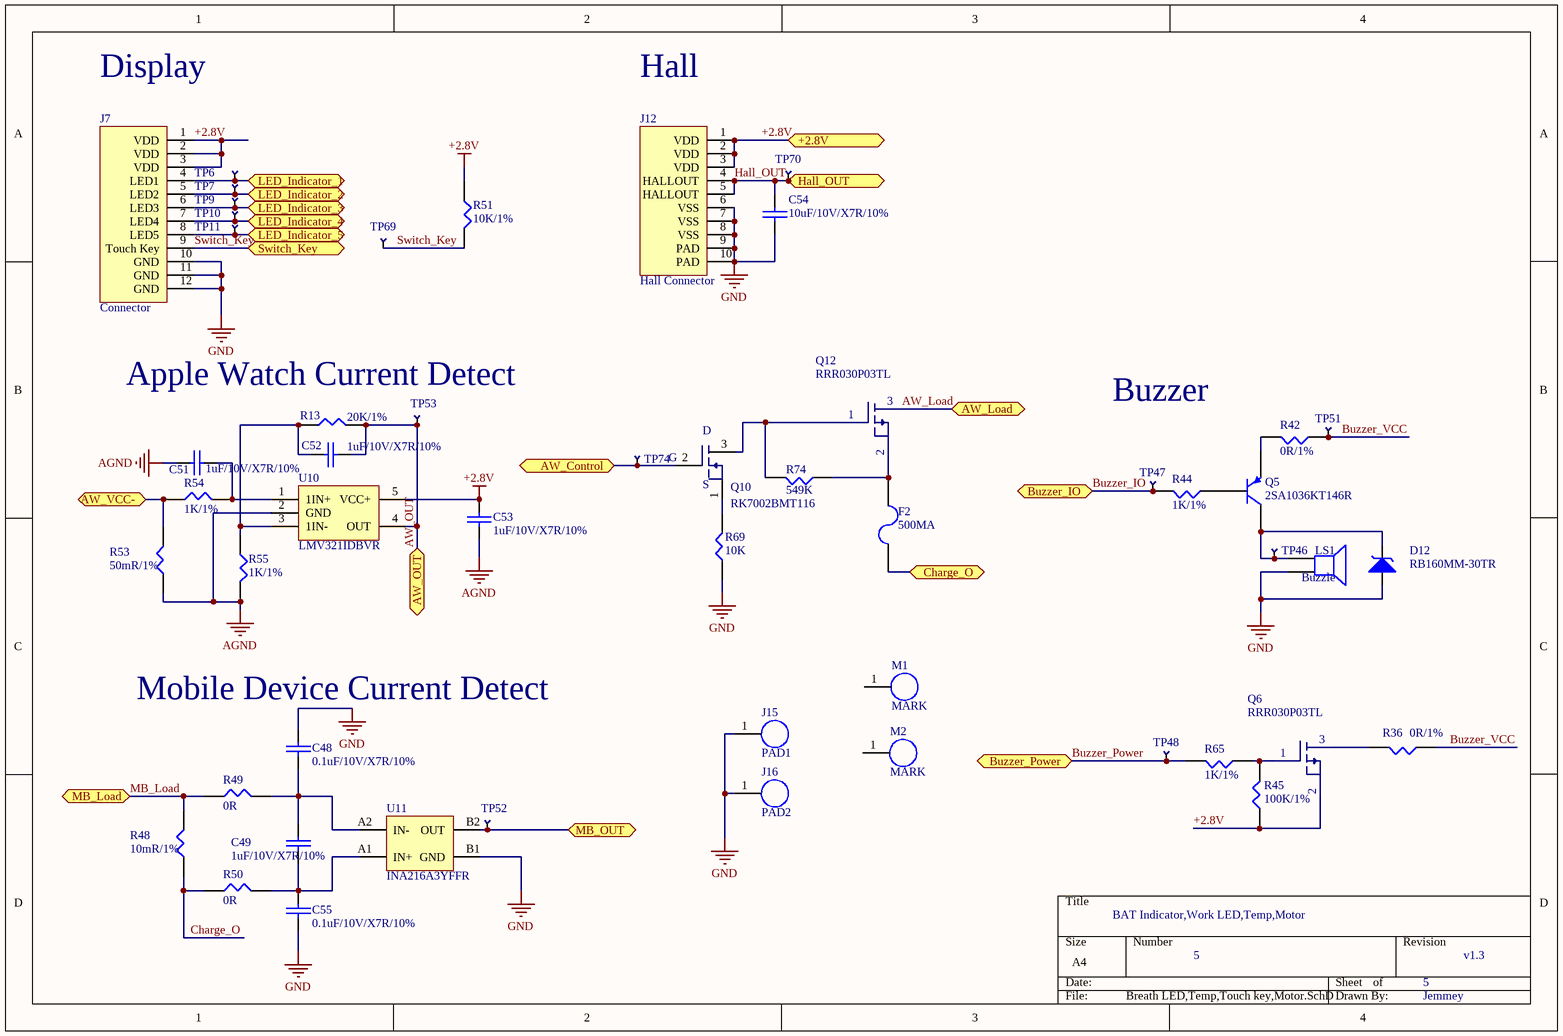
[diagram p4: Breath LED,Temp,Touch key,Motor.SchDoc]

### Parts
C48  0.1uF/10V/X7R/10%  [0402C]
C49  1uF/10V/X7R/10%  [0402C]
C51  1uF/10V/X7R/10%  [0402C]
C52  1uF/10V/X7R/10%  [0402C]
C53  1uF/10V/X7R/10%  [0402C]
C54  10uF/10V/X7R/10%  [0603C]
C55  0.1uF/10V/X7R/10%  [0402C]
D12  RB160MM-30TR  [DO-214AC]
F2  500MA  [1206-FUSE]
J7  Connector  [FPC_CON12-BACK-MOLEX]
J12  Hall Connector  [FPC_CON8-KYOCERA]
J15  PAD1  [PAD1]
J16  PAD2  [PAD2]
LS1  Buzzle  [Buzzer 7525]
M1  MARK  [Mark Point]
M2  MARK  [Mark Point]
Q5  2SA1036KT146R  [SMT3]
Q6  RRR030P03TL  [TSMT3]
Q10  RK7002BMT116  [SOT23]
Q12  RRR030P03TL  [TSMT3]
R13  20K/1%  [0402R]
R36  0R/1%  [0603R]
R42  0R/1%  [0402R]
R44  1K/1%  [0402R]
R45  100K/1%  [0402R]
R48  10mR/1%  [0805]
R49  0R  [0603R]
R50  0R  [0603R]
R51  10K/1%  [0402R]
R53  50mR/1%  [0805]
R54  1K/1%  [0402R]
R55  1K/1%  [0402R]
R65  1K/1%  [0402R]
R69  10K  [0402R]
R74  549K  [0402R]
TP6  TEST  [Test Pad]  (value not drawn)
TP7  TEST  [Test Pad]  (value not drawn)
TP9  TEST  [Test Pad]  (value not drawn)
TP10  TEST  [Test Pad]  (value not drawn)
TP11  TEST  [Test Pad]  (value not drawn)
TP46  TEST  [Test Pad]  (value not drawn)
TP47  TEST  [Test Pad]  (value not drawn)
TP48  TEST  [Test Pad]  (value not drawn)
TP51  TEST  [Test Pad]  (value not drawn)
TP52  TEST  [Test Pad]  (value not drawn)
TP53  TEST  [Test Pad]  (value not drawn)
TP69  TEST  [Test Pad]  (value not drawn)
TP70  TEST  [Test Pad]  (value not drawn)
TP74  TEST  [Test Pad]  (value not drawn)
U10  LMV321IDBVR  [SOT23-5]
U11  INA216A3YFFR  [YFF]

### Ports
+2.8V, AW_Control, AW_Load, AW_OUT (bidir), AW_VCC- (bidir), Buzzer_IO, Buzzer_Power, Charge_O, Hall_OUT, LED_Indicator_1, LED_Indicator_2, LED_Indicator_3, LED_Indicator_4, LED_Indicator_5, MB_Load (bidir), MB_OUT (bidir), Switch_Key

### Nets
+2.8V: C53.2 J7.1(VDD) J7.2(VDD) J7.3(VDD) J12.1(VDD) J12.2(VDD) J12.3(VDD) Q6.2(S) R45.1 R51.1 U10.5(VCC+) ; port +2.8V
AGND: C51.1 C53.1 R53.1 R55.2 U10.2(GND)
GND: C48.1 C54.2 C55.2 D12.2(A) J7.10(GND) J7.11(GND) J7.12(GND) J12.6(VSS) J12.7(VSS) J12.8(VSS) J12.9(PAD) J12.10(PAD) J15.1 J16.1 LS1.2 R69.1 U11.B1(GND)
AW_Load: Q12.3(D) ; port AW_Load
AW_OUT: C52.2 R13.2 TP53.1 U10.4(OUT) ; port AW_OUT
AW_VCC-: R53.2 R54.1 ; port AW_VCC-
Buzzer_IO: R44.2 TP47.1 ; port Buzzer_IO
Buzzer_Power: R65.2 TP48.1 ; port Buzzer_Power
Buzzer_VCC: R36.1 R42.1 TP51.1
Charge_O: F2.2 R48.1 R50.1 ; port Charge_O
Hall_OUT: C54.1 J12.4(HALLOUT) J12.5(HALLOUT) TP70.1 ; port Hall_OUT
MB_LOAD: R48.2 R49.1 ; port MB_Load
Switch_Key: J7.9(Touch_Key) R51.2 TP69.1 ; port Switch_Key
NetC48_2: C48.2 C49.1 R49.2 U11.A2(IN-)
NetC49_2: C49.2 C55.1 R50.2 U11.A1(IN+)
NetC51_2: C51.2 R54.2 U10.1(1IN+)
NetC52_1: C52.1 R13.1 R55.1 U10.3(1IN-)
NetD12_1: D12.1(K) LS1.1 Q5.1(E) TP46.1
NetF2_1: F2.1 Q12.2(S) R74.1
NetJ7_4: J7.4(LED1) TP6.1 ; port LED_Indicator_1
NetJ7_5: J7.5(LED2) TP7.1 ; port LED_Indicator_2
NetJ7_6: J7.6(LED3) TP9.1 ; port LED_Indicator_3
NetJ7_7: J7.7(LED4) TP10.1 ; port LED_Indicator_4
NetJ7_8: J7.8(LED5) TP11.1 ; port LED_Indicator_5
NetQ5_2: Q5.2(B) R44.1
NetQ5_3: Q5.3(C) R42.2
NetQ6_1: Q6.1(G) R45.2 R65.1
NetQ6_3: Q6.3(D) R36.2
NetQ10_1: Q10.1(S) R69.2
NetQ10_2: Q10.2(G) TP74.1 ; port AW_Control
NetQ10_3: Q10.3(D) Q12.1(G) R74.2
NetR61_1: TP52.1 U11.B2(OUT) ; port MB_OUT

Not connected (* = marked no-connect by the designer): M1 1; M2 1

### Notes on the sheet
- Display
- Hall
- Apple Watch Current Detect
- Buzzer
- (near C48) Mobile Device Current Detect
- BAT Indicator,Work LED,Temp,Motor
- 5
- v1.3
- Jemmey

### Library data of the parts
C48 C55 = CAP: 厂家：Murata，型号：GRM155R71A104KA01D
C49 C51-C53 = CAP: 厂家：Murata，型号：GRM155R61C105KA12D
C54 = CAP: 厂家：Murata，型号：GRM188R61A106KE69D
D12 = Schottky barri: 厂家：ROHM，型号：RB160MM-30TR
F2 = FUSE2: 厂家：万瑞和，型号：WH1206-050
J7 = Temp Con: 厂家：Molex，型号：5034801200_sd
J12 = Temp C: 厂家：京瓷，型号：046298008 000883+
J15 M1 M2 = PAD1: None
J16 = PAD2: None
LS1 = Speaker: 厂家：常州超音电子，型号：SMD-8503-3016-2.7K
Q5 = PNP: 厂家：ROHM，型号：2SA1036KT146R
Q6 Q12 = PMOS: 厂家：ROHM，型号：RRR030P03TL
Q10 = RK7002BMT116: 厂家：ROHM，型号：RK7002BMT116
R13 = RES1: 厂家：Yageo，型号：RC0402FR-0720KL
R36 R42 = RES1: 厂家：Yageo，型号：RC0402FR-070RL
R44 R65 = RES: 厂家：Yageo，型号：RC0402FR-071KL
R45 = RES: 厂家：Yageo，型号：RC0402FR-07100KL
R48 = RES1: 厂家：Yageo，型号：RL0805FR-070R01L
R49 R50 = RES1: 厂家：Yageo，型号：RC0603FR-070RL
R51 = RES1: 厂家：Yageo，型号：RC0402FR-0710KL
R53 = RES1: 厂家：Yageo，型号：RL0805FR-070R05L
R54 R55 = RES1: 厂家：Yageo，型号：RC0402FR-071KL
R69 R74 = RES1
TP6 TP7 TP9-TP11 TP46-TP48 TP51-TP53 TP69 TP70 = TEST: Test Point
U10 = LMV321IDBVR: 厂家：TI，型号：LMV321IDBVR
U11 = INA216A3YFFR: 厂家：TI，型号：INA216A3YFFR

## Nets that join several sheets
+2.8V: Charge,Discharge,Battery Monitor,DC DC BUCK (8 pins), Management of Charging,Discharging,Tri-axis angle sensor (R18.1 R19.1 R20.1 R21.1), BLE MCU,Watch Dog and Reset,EEPROM,Buzzer (5 pins), Breath LED,Temp,Touch key,Motor (11 pins)
AGND: BLE MCU,Watch Dog and Reset,EEPROM,Buzzer (C50.2 D16.2 L3.1), Breath LED,Temp,Touch key,Motor (5 pins)
GND: Charge,Discharge,Battery Monitor,DC DC BUCK (48 pins), WindCharger (7 pins), Management of Charging,Discharging,Tri-axis angle sensor (25 pins), BLE MCU,Watch Dog and Reset,EEPROM,Buzzer (37 pins), Breath LED,Temp,Touch key,Motor (17 pins)
Adapter: Charge,Discharge,Battery Monitor,DC DC BUCK (D2.2 L5.2 TP1.1), WindCharger (Q4.4 Q4.8 R34.2 R57.2), Management of Charging,Discharging,Tri-axis angle sensor (6 pins)
AW_Load: Charge,Discharge,Battery Monitor,DC DC BUCK (13 pins), Breath LED,Temp,Touch key,Motor (Q12.3)
AW_OUT: BLE MCU,Watch Dog and Reset,EEPROM,Buzzer (R58.1), Breath LED,Temp,Touch key,Motor (C52.2 R13.2 TP53.1 U10.4)
AW_VCC-: Charge,Discharge,Battery Monitor,DC DC BUCK (5 pins), Breath LED,Temp,Touch key,Motor (R53.2 R54.1)
BAT: Charge,Discharge,Battery Monitor,DC DC BUCK (5 pins), Management of Charging,Discharging,Tri-axis angle sensor (5 pins)
Buzzer_IO: BLE MCU,Watch Dog and Reset,EEPROM,Buzzer (U6.41), Breath LED,Temp,Touch key,Motor (R44.2 TP47.1)
Buzzer_Power: BLE MCU,Watch Dog and Reset,EEPROM,Buzzer (U6.40), Breath LED,Temp,Touch key,Motor (R65.2 TP48.1)
Charge_O: WindCharger (17 pins), Breath LED,Temp,Touch key,Motor (F2.2 R48.1 R50.1)
DC/DC_CTRL: Charge,Discharge,Battery Monitor,DC DC BUCK (R7.1 U2.4), BLE MCU,Watch Dog and Reset,EEPROM,Buzzer (U6.27)
DC/DC_PG: Charge,Discharge,Battery Monitor,DC DC BUCK (R6.1 U2.7), BLE MCU,Watch Dog and Reset,EEPROM,Buzzer (U6.18)
GPOUT: Charge,Discharge,Battery Monitor,DC DC BUCK (R3.1 TP5.1 U1.12), BLE MCU,Watch Dog and Reset,EEPROM,Buzzer (U6.15)
Hall_OUT: BLE MCU,Watch Dog and Reset,EEPROM,Buzzer (U6.47), Breath LED,Temp,Touch key,Motor (C54.1 J12.4 J12.5 TP70.1)
IIC_A_M_BAT_SCL: Management of Charging,Discharging,Tri-axis angle sensor (R18.2 TP29.1 U3.5), BLE MCU,Watch Dog and Reset,EEPROM,Buzzer (U6.20)
IIC_A_M_BAT_SDA: Management of Charging,Discharging,Tri-axis angle sensor (R19.2 TP27.1 U3.6), BLE MCU,Watch Dog and Reset,EEPROM,Buzzer (U6.21)
IIC_A_SCL_BAT: Charge,Discharge,Battery Monitor,DC DC BUCK (R2.1 TP8.1 U1.2), BLE MCU,Watch Dog and Reset,EEPROM,Buzzer (U6.17)
IIC_A_SDA_BAT: Charge,Discharge,Battery Monitor,DC DC BUCK (R1.1 TP4.1 U1.1), BLE MCU,Watch Dog and Reset,EEPROM,Buzzer (U6.16)
INT_CHG: Management of Charging,Discharging,Tri-axis angle sensor (R21.2 TP30.1 U3.7), BLE MCU,Watch Dog and Reset,EEPROM,Buzzer (U6.22)
MB_LOAD: Charge,Discharge,Battery Monitor,DC DC BUCK (L6.2), Breath LED,Temp,Touch key,Motor (R48.2 R49.1)
NetJ7_4: BLE MCU,Watch Dog and Reset,EEPROM,Buzzer (U6.3), Breath LED,Temp,Touch key,Motor (J7.4 TP6.1)
NetJ7_5: BLE MCU,Watch Dog and Reset,EEPROM,Buzzer (U6.4), Breath LED,Temp,Touch key,Motor (J7.5 TP7.1)
NetJ7_6: BLE MCU,Watch Dog and Reset,EEPROM,Buzzer (U6.5), Breath LED,Temp,Touch key,Motor (J7.6 TP9.1)
NetJ7_7: BLE MCU,Watch Dog and Reset,EEPROM,Buzzer (U6.6), Breath LED,Temp,Touch key,Motor (J7.7 TP10.1)
NetJ7_8: BLE MCU,Watch Dog and Reset,EEPROM,Buzzer (U6.48), Breath LED,Temp,Touch key,Motor (J7.8 TP11.1)
NetQ10_2: BLE MCU,Watch Dog and Reset,EEPROM,Buzzer (U6.25), Breath LED,Temp,Touch key,Motor (Q10.2 TP74.1)
NetR61_1: BLE MCU,Watch Dog and Reset,EEPROM,Buzzer (R61.1), Breath LED,Temp,Touch key,Motor (TP52.1 U11.B2)
NTC: Charge,Discharge,Battery Monitor,DC DC BUCK (Us1.2), Management of Charging,Discharging,Tri-axis angle sensor (5 pins)
ON/OFF: Charge,Discharge,Battery Monitor,DC DC BUCK (Q8.4 Q8.5 R39.1 TP71.1), BLE MCU,Watch Dog and Reset,EEPROM,Buzzer (U6.28)
Plug_Detect: Charge,Discharge,Battery Monitor,DC DC BUCK (R62.1 TP72.1), BLE MCU,Watch Dog and Reset,EEPROM,Buzzer (U6.14)
PMID: WindCharger (Q9.4 Q9.8), Management of Charging,Discharging,Tri-axis angle sensor (6 pins)
STAT_INT: Management of Charging,Discharging,Tri-axis angle sensor (R20.2 TP26.1 U3.4), BLE MCU,Watch Dog and Reset,EEPROM,Buzzer (U6.19)
Switch_Key: BLE MCU,Watch Dog and Reset,EEPROM,Buzzer (U6.42), Breath LED,Temp,Touch key,Motor (J7.9 R51.2 TP69.1)
SYS_VCC: Charge,Discharge,Battery Monitor,DC DC BUCK (6 pins), Management of Charging,Discharging,Tri-axis angle sensor (F1.1)